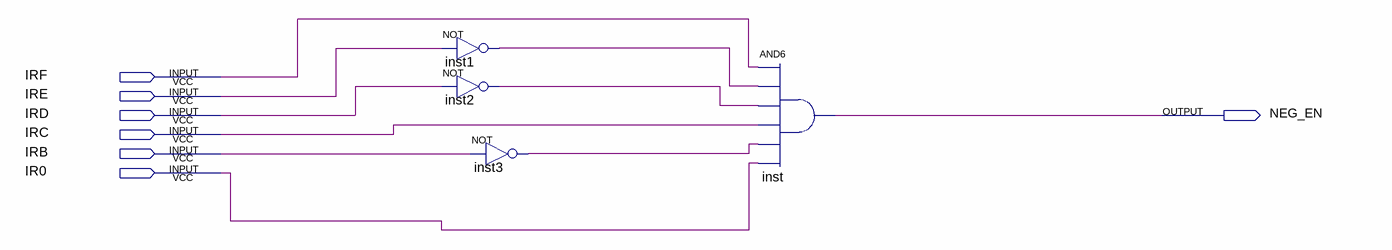
[diagram p0: schematic sheet]
// Quartus schematic NEG_EN.bdf as structural Verilog: 4 symbols, 7 pins
module NEG_EN (
  input  IRF,
  input  IRE,
  input  IRD,
  input  IRC,
  input  IRB,
  input  IR0,
  output NEG_EN
);

  wire inst1_out, inst2_out, inst3_out;

  not inst1 (inst1_out, IRE);
  not inst2 (inst2_out, IRD);
  not inst3 (inst3_out, IRB);
  and inst (NEG_EN, IRF, inst1_out, inst2_out, IRC, inst3_out, IR0);
endmodule
